# Altium schematic sheet Analog.SchDoc: DaughterBoard Tester
size Letter; DrawnBy: MTAN; Organization: Altium Limited; DocumentNumber: 4; Revision: A; SheetNumber: 4; SheetTotal: 6
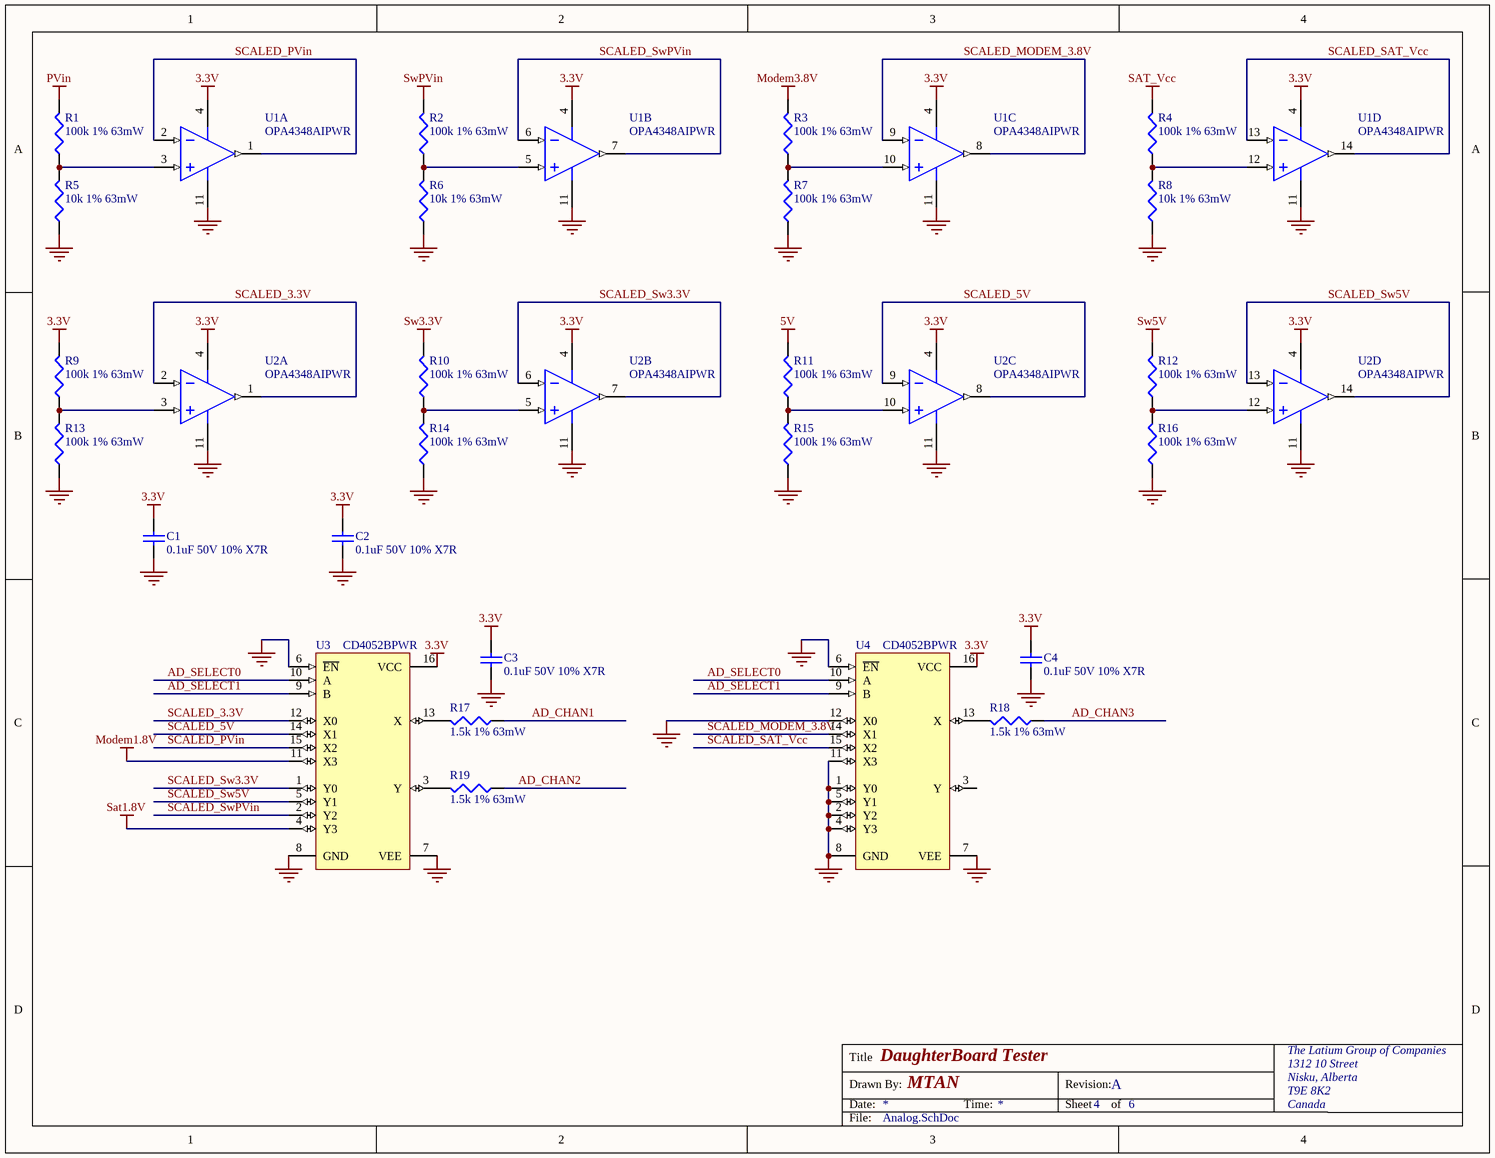
[diagram p0: Analog.SchDoc]

## Parts
C1  0.1uF 50V 10% X7R  [CAPC1005L]
C2  0.1uF 50V 10% X7R  [CAPC1005L]
C3  0.1uF 50V 10% X7R  [CAPC1005L]
C4  0.1uF 50V 10% X7R  [CAPC1005L]
R1  100k 1% 63mW  [RESC1005L]
R2  100k 1% 63mW  [RESC1005L]
R3  100k 1% 63mW  [RESC1005L]
R4  100k 1% 63mW  [RESC1005L]
R5  10k 1% 63mW  [RESC1005L]
R6  10k 1% 63mW  [RESC1005L]
R7  100k 1% 63mW  [RESC1005L]
R8  10k 1% 63mW  [RESC1005L]
R9  100k 1% 63mW  [RESC1005L]
R10  100k 1% 63mW  [RESC1005L]
R11  100k 1% 63mW  [RESC1005L]
R12  100k 1% 63mW  [RESC1005L]
R13  100k 1% 63mW  [RESC1005L]
R14  100k 1% 63mW  [RESC1005L]
R15  100k 1% 63mW  [RESC1005L]
R16  100k 1% 63mW  [RESC1005L]
R17  1.5k 1% 63mW  [RESC1005L]
R18  1.5k 1% 63mW  [RESC1005L]
R19  1.5k 1% 63mW  [RESC1005L]
U1  OPA4348AIPWR  [TI-PW14_L]  (parts A,B,C,D of 4)
U2  OPA4348AIPWR  [TI-PW14_L]  (parts A,B,C,D of 4)
U3  CD4052BPWR  [TSSOP-16_L]
U4  CD4052BPWR  [TSSOP-16_L]

## Nets
3.3V: C1.1 C2.1 C3.1 C4.1 R9.2 U1.4(V+) U2.4(V+) U3.16(VCC) U4.16(VCC)
5V: R11.2
GND: C1.2 C2.2 C3.2 C4.2 R5.1 R6.1 R7.1 R8.1 R13.1 R14.1 R15.1 R16.1 U1.11(V-) U2.11(V-) U3.6(~{EN}) U3.7(VEE) U3.8(GND) U4.1(Y0) U4.2(Y2) U4.4(Y3) U4.5(Y1) U4.6(~{EN}) U4.7(VEE) U4.8(GND) U4.11(X3) U4.12(X0)
Modem1.8V: U3.11(X3)
Modem3.8V: R3.2
PVin: R1.2
Sat1.8V: U3.4(Y3)
SAT_Vcc: R4.2
Sw3.3V: R10.2
Sw5V: R12.2
SwPVin: R2.2
AD_CHAN1: R17.1
AD_CHAN2: R19.1
AD_CHAN3: R18.1
AD_SELECT0: U3.10(A) U4.10(A)
AD_SELECT1: U3.9(B) U4.9(B)
SCALED_3.3V: U2.1(OUT_A) U2.2(IN_A-) U3.12(X0)
SCALED_5V: U2.8(OUT_C) U2.9(IN_C-) U3.14(X1)
SCALED_MODEM_3.8V: U1.8(OUT_C) U1.9(IN_C-) U4.14(X1)
SCALED_PVin: U1.1(OUT_A) U1.2(IN_A-) U3.15(X2)
SCALED_SAT_Vcc: U1.13(IN_D-) U1.14(OUT_D) U4.15(X2)
SCALED_Sw3.3V: U2.6(IN_B-) U2.7(OUT_B) U3.1(Y0)
SCALED_Sw5V: U2.13(IN_D-) U2.14(OUT_D) U3.5(Y1)
SCALED_SwPVin: U1.6(IN_B-) U1.7(OUT_B) U3.2(Y2)
NetR1_1: R1.1 R5.2 U1.3(IN_A+)
NetR2_1: R2.1 R6.2 U1.5(IN_B+)
NetR3_1: R3.1 R7.2 U1.10(IN_C+)
NetR4_1: R4.1 R8.2 U1.12(IN_D+)
NetR9_1: R9.1 R13.2 U2.3(IN_A+)
NetR10_1: R10.1 R14.2 U2.5(IN_B+)
NetR11_1: R11.1 R15.2 U2.10(IN_C+)
NetR12_1: R12.1 R16.2 U2.12(IN_D+)
NetR17_2: R17.2 U3.13(X)
NetR18_2: R18.2 U4.13(X)
NetR19_2: R19.2 U3.3(Y)

Not connected (* = marked no-connect by the designer): U4 3(Y)

## Notes on the sheet
- Title
- Drawn By:
- Date:
- Time:
- Revision:
- Sheet
- of
- The Latium Group of Companies
- 1312 10 Street
- Nisku, Alberta
- T9E 8K2
- Canada
- File:

## Library data of the parts
C1-C4 = Cap: Capacitor; Value: 0.1uF 50V 10% X7R
R1-R19 = Res3: Resistor
  R1-R4 R7 R9-R16: Value: 100k 1% 63mW
  R5 R6 R8: Value: 10k 1% 63mW
  R17-R19: Value: 1.5k 1% 63mW
U1 U2 = OPA4348AIPWR: IC OPAMP GP 4 CIRCUIT 14TSSOP; Manufacturer: Texas Instruments; Value: OPA4348AIPWR; Manufacturer Part Number: OPA4348AIPWR; Supplier 1: Digi-Key; Supplier 1 Part Number: 296-29283-1-ND
U3 U4 = CD4052BCM: IC MUX/DEMUX DUAL 4X1 16TSSOP; Manufacturer: Texas Instruments; Value: CD4052BPWR; Manufacturer Part Number: CD4052BPWR; Supplier 1: Digi-Key; Supplier 1 Part Number: 296-14273-1-ND